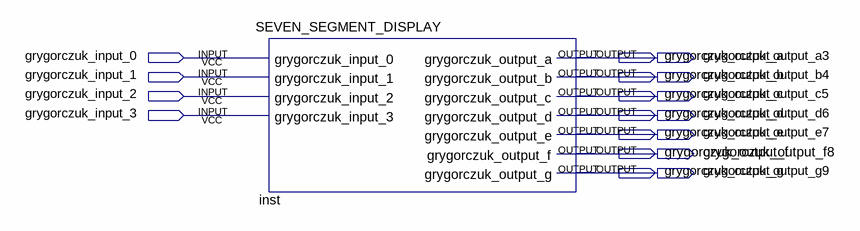
[diagram p0: schematic sheet]
// Quartus schematic SEVEN_SEGMENT_DISPLAY_SYMBOL.bdf as structural Verilog: 1 symbols, 18 pins
module SEVEN_SEGMENT_DISPLAY_SYMBOL (
  input  grygorczuk_input_0,
  input  grygorczuk_input_1,
  input  grygorczuk_input_2,
  input  grygorczuk_input_3,
  output grygorczuk_output_a,
  output grygorczuk_output_a3,
  output grygorczuk_output_b,
  output grygorczuk_output_b4,
  output grygorczuk_output_c,
  output grygorczuk_output_c5,
  output grygorczuk_output_d,
  output grygorczuk_output_d6,
  output grygorczuk_output_e,
  output grygorczuk_output_e7,
  output grygorczuk_output_f,
  output grygorczuk_output_f8,
  output grygorczuk_output_g,
  output grygorczuk_output_g9
);

  SEVEN_SEGMENT_DISPLAY inst (
    .grygorczuk_input_0(grygorczuk_input_0), .grygorczuk_input_1(grygorczuk_input_1),
    .grygorczuk_input_2(grygorczuk_input_2), .grygorczuk_input_3(grygorczuk_input_3),
    .grygorczuk_output_a(grygorczuk_output_a3), .grygorczuk_output_b(grygorczuk_output_b4),
    .grygorczuk_output_c(grygorczuk_output_c5), .grygorczuk_output_d(grygorczuk_output_d6),
    .grygorczuk_output_e(grygorczuk_output_e7), .grygorczuk_output_f(grygorczuk_output_f8),
    .grygorczuk_output_g(grygorczuk_output_g9));
endmodule
